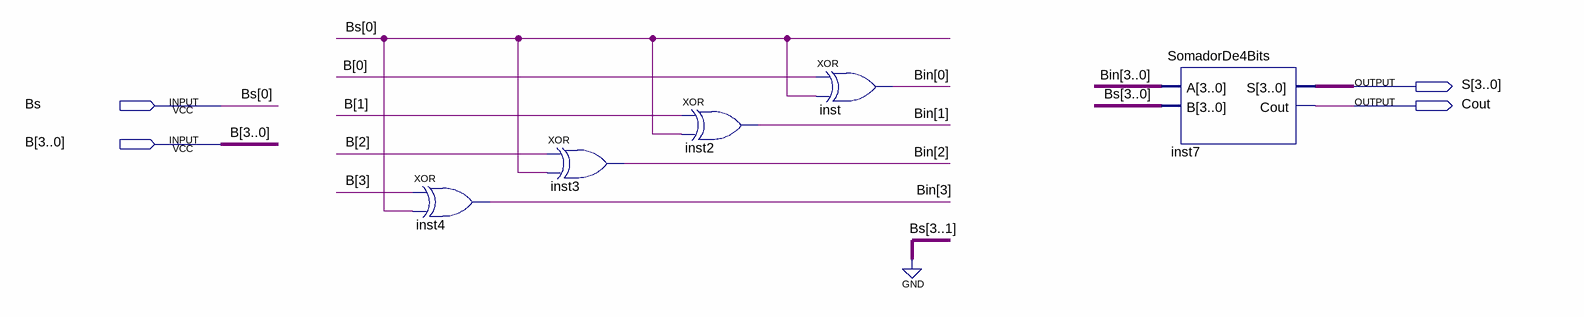
[diagram p0: schematic sheet]
// Quartus schematic InverteSoma1.bdf as structural Verilog: 5 symbols, 4 pins
module InverteSoma1 (
  input  Bs,
  input  [3:0] B,
  output [3:0] S,
  output Cout
);

  wire [3:0] Bin;

  xor inst4 (Bin[3], B[3], Bs);
  xor inst3 (Bin[2], B[2], Bs);
  xor inst2 (Bin[1], B[1], Bs);
  xor inst (Bin[0], B[0], Bs);
  SomadorDe4Bits inst7 (.A(Bin), .B({3'b000, Bs}), .S(S), .Cout(Cout));

  // Other names for the same wires on the sheet: Bs[0] = Bs
endmodule
